# Altium schematic sheet ControladorPOE.SchDoc
size A4; SheetNumber: 8; SheetTotal: 10
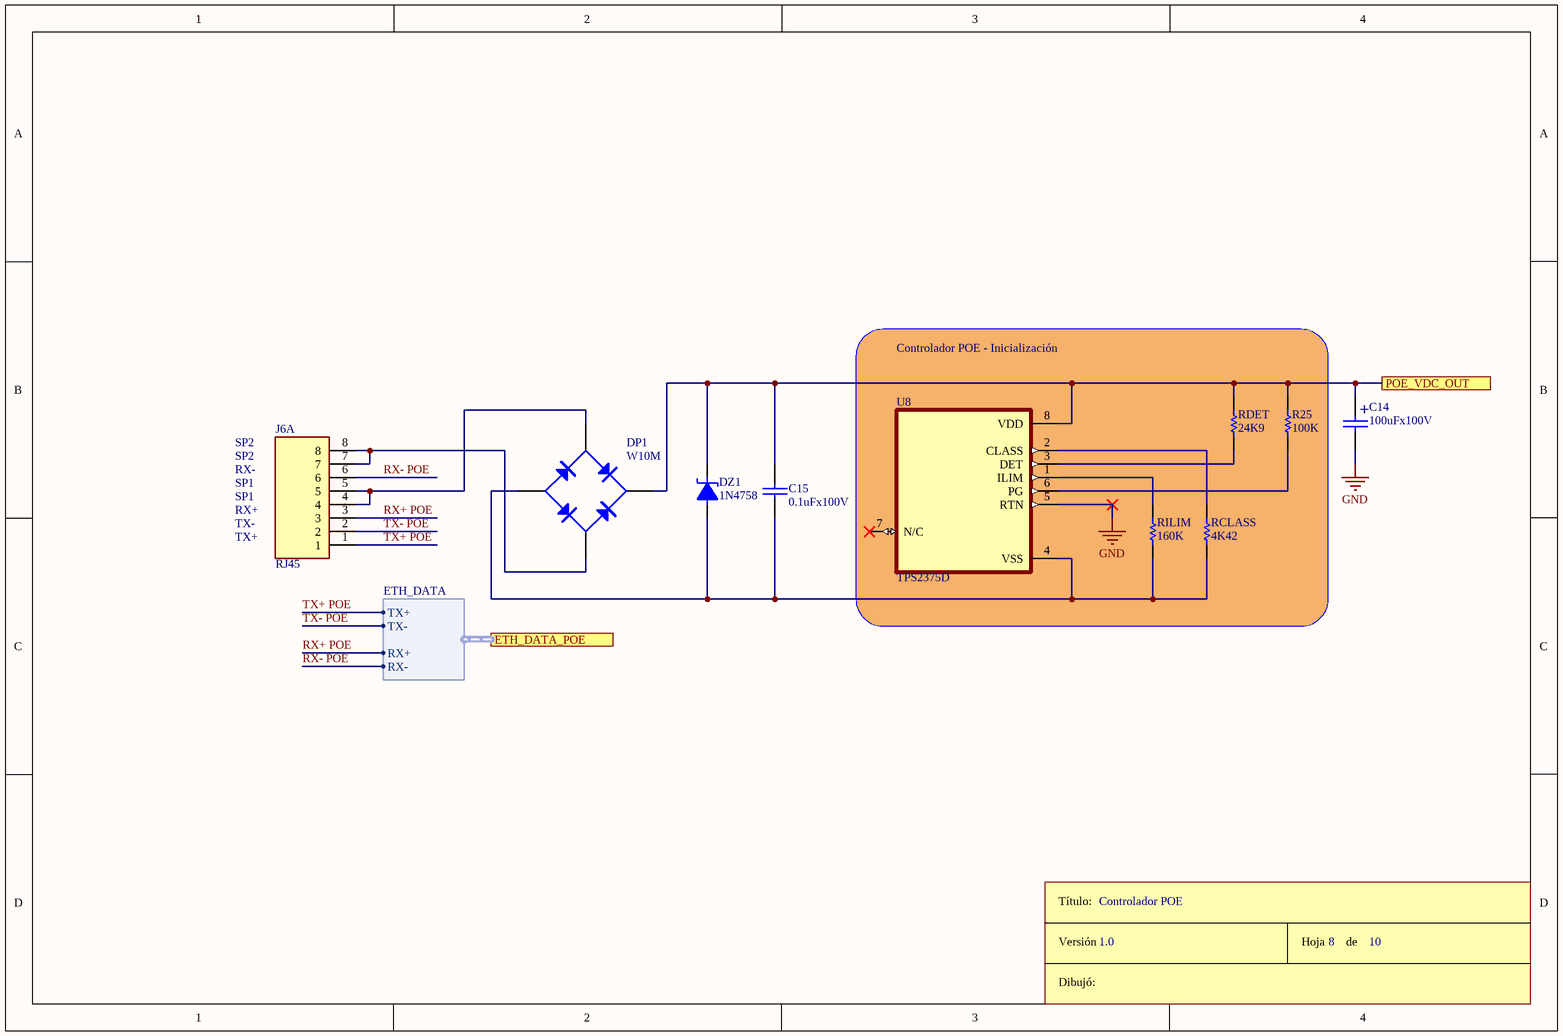
[diagram p0: ControladorPOE.SchDoc]

## Parts
C14  100uFx100V  [CAP200RP]
C15  0.1uFx100V  [CAP300]
DP1  W10M  [PUENTE - W10M]
DZ1  1N4758  [DO41]
J6A  RJ45  [CUI_CRJ032-1-TH]
R25  100K  [RES300]
RCLASS  4K42  [RES300]
RDET  24K9  [RES300]
RILIM  160K  [RES300]
ROT7  Rótulo  (value not drawn)  (graphical)
U8  TPS2375D  [SOIC127P599X175-8N]

## Blocks framed on the sheet
Controlador POE - Inicialización: R25 RCLASS RDET RILIM U8

## Ports
ETH_DATA_POE (harness ETH_DATA), POE_VDC_OUT

## Harnesses
ETH_DATA: TX+, TX-, RX+, RX-

## Nets
GND: C14.2 U8.5(RTN)
POE_VDC_OUT: C14.1 C15.1 DP1.1(V+) DZ1.2 R25.2 RDET.2 U8.8(VDD) ; port POE_VDC_OUT
RX+ POE: J6A.3 ; port ETH_DATA_POE.RX+
RX- POE: J6A.6 ; port ETH_DATA_POE.RX-
TX+ POE: J6A.1 ; port ETH_DATA_POE.TX+
TX- POE: J6A.2 ; port ETH_DATA_POE.TX-
NetC15_2: C15.2 DP1.3(V-) DZ1.1 RCLASS.1 RILIM.1 U8.4(VSS)
NetDP1_2: DP1.2(AC) J6A.4 J6A.5
NetDP1_4: DP1.4(AC) J6A.7 J6A.8
NetR25_1: R25.1 U8.6(PG)
NetRCLASS_2: RCLASS.2 U8.2(CLASS)
NetRDET_1: RDET.1 U8.3(DET)
NetRILIM_2: RILIM.2 U8.1(ILIM)

Not connected (* = marked no-connect by the designer): U8 7(N/C)*

## Notes on the sheet
- SP2
- RX+
- RX-
- SP1
- TX+
- TX-
- Controlador POE
- 1.0
- 8
- 10
- (in symbol CAPPOL) +
- (in symbol Rótulo) Título:; Versión; Hoja       de; Dibujó:

## Library data of the parts
C14 = CAPPOL
C15 = CAP
DP1 = PUENTE
DZ1 = DIODO ZENER
J6A = CRJ032-1-TH: 8P8C, Single Port, Horizontal, Unshielded, No LED, Through Hole, RJ45 Modular Connector; MF: CUI Devices; MP: CRJ032-1-TH; SnapEDA_Link: https://www.snapeda.com/parts/CRJ032-1-TH/CUI%20Devices/view-part/6363031/?ref=snap; Availability: In Stock; CUI_purchase_URL: https://www.cuidevices.com/product/interconnect/connectors/modular-connectors/rj45-connectors/crj032-1-th?utm_source=snapeda.com&utm_medium=referral&utm_campaign=snapedaBOM; Check_prices: https://www.snapeda.com/parts/CRJ032-1-TH/CUI%20Devices/view-part/6363031/?ref=eda; Value: *; Purchase-URL: https://pricing.snapeda.com/search/part/CRJ032-1-TH/?ref=eda; Package: None; Price: None
R25 RCLASS RDET RILIM = RES
U8 = TPS2375D: Class 3 PoE PD with latch protection 8-SOIC -40 to 85; MF: Texas Instruments; Purchase-URL: https://pricing.snapeda.com/search/part/TPS2375D/?ref=eda; MP: TPS2375D; Package: SOIC-8 Texas Instruments; SnapEDA_Link: https://www.snapeda.com/parts/TPS2375D/Texas%20Instruments/view-part/570877/?ref=snap; Value: *; Check_prices: https://www.snapeda.com/parts/TPS2375D/Texas%20Instruments/view-part/570877/?ref=eda; Digi-Key_Part_Number: 296-26922-2-ND